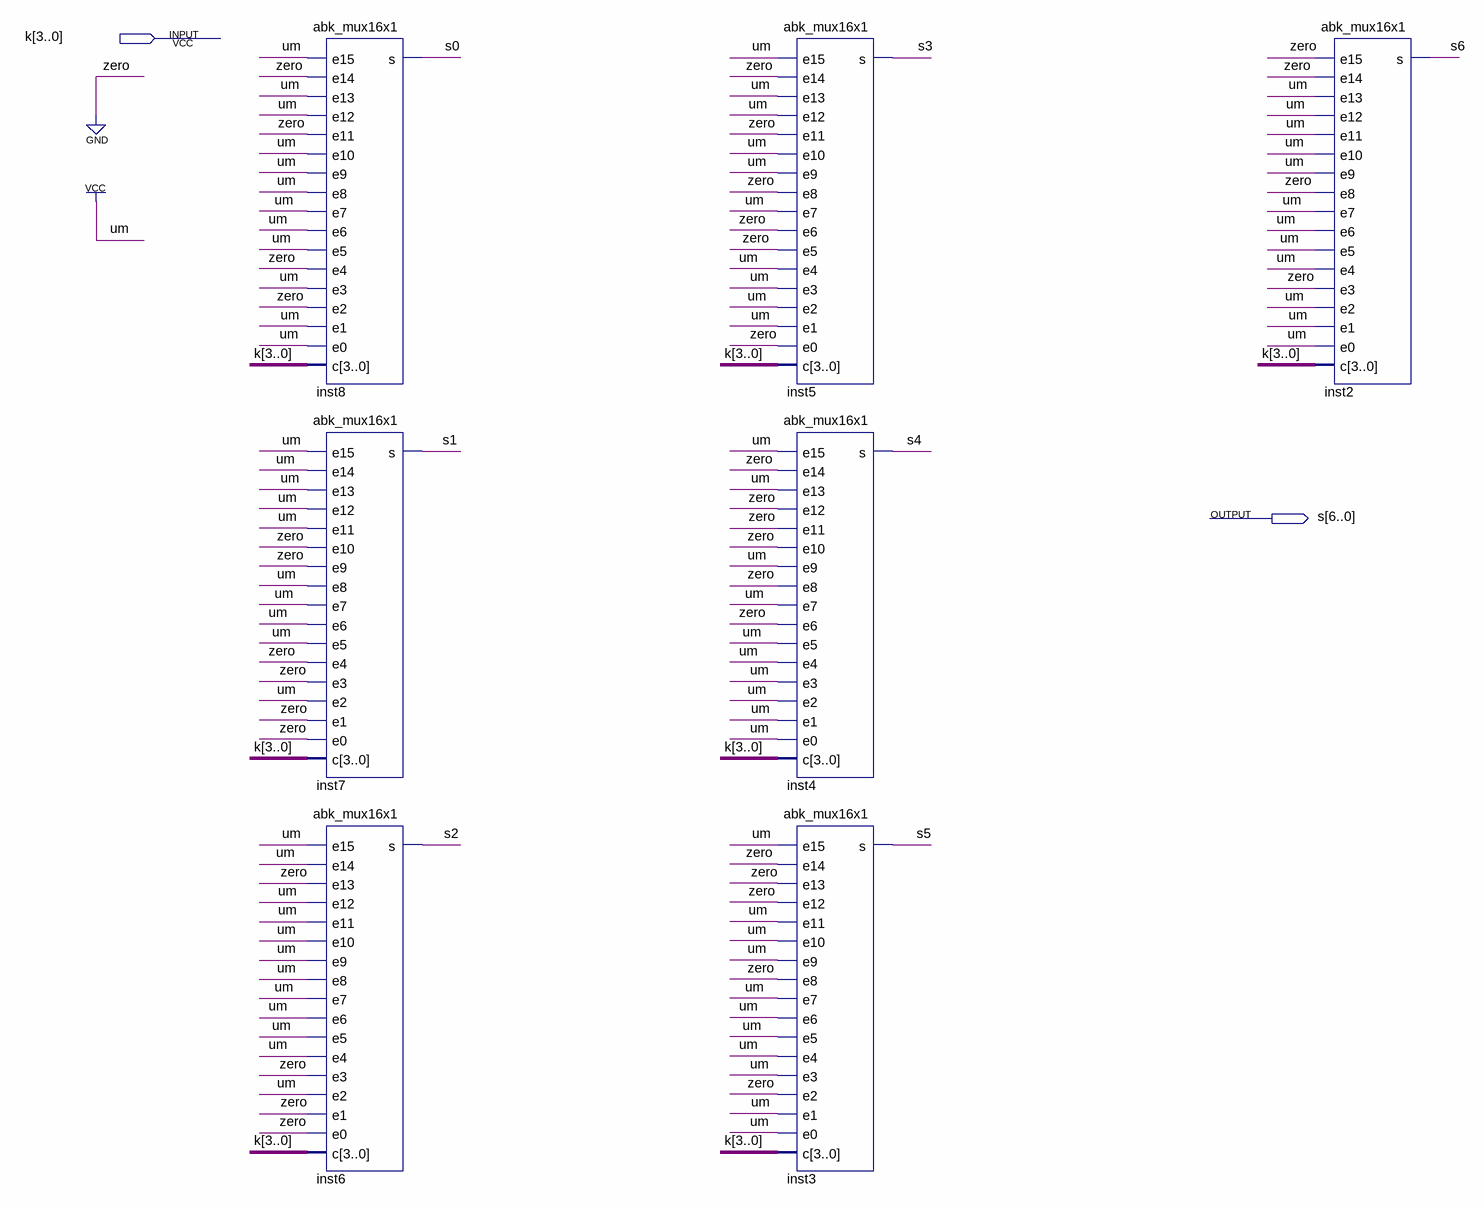
[diagram p0: schematic sheet]
// Quartus schematic abk_display_7.bdf as structural Verilog: 7 symbols, 2 pins
module abk_display_7 (
  input  [3:0] k,
  output [6:0] s
);

  abk_mux16x1 inst8 (
    .e15(1'b1), .e14(1'b0), .e13(1'b1), .e12(1'b1), .e11(1'b0), .e10(1'b1), .e9(1'b1), .e8(1'b1), .e7(1'b1),
    .e6(1'b1), .e5(1'b1), .e4(1'b0), .e3(1'b1), .e2(1'b0), .e1(1'b1), .e0(1'b1), .c(k), .s(s[0]));
  abk_mux16x1 inst7 (
    .e15(1'b1), .e14(1'b1), .e13(1'b1), .e12(1'b1), .e11(1'b1), .e10(1'b0), .e9(1'b0), .e8(1'b1), .e7(1'b1),
    .e6(1'b1), .e5(1'b1), .e4(1'b0), .e3(1'b0), .e2(1'b1), .e1(1'b0), .e0(1'b0), .c(k), .s(s[1]));
  abk_mux16x1 inst6 (
    .e15(1'b1), .e14(1'b1), .e13(1'b0), .e12(1'b1), .e11(1'b1), .e10(1'b1), .e9(1'b1), .e8(1'b1), .e7(1'b1),
    .e6(1'b1), .e5(1'b1), .e4(1'b1), .e3(1'b0), .e2(1'b1), .e1(1'b0), .e0(1'b0), .c(k), .s(s[2]));
  abk_mux16x1 inst5 (
    .e15(1'b1), .e14(1'b0), .e13(1'b1), .e12(1'b1), .e11(1'b0), .e10(1'b1), .e9(1'b1), .e8(1'b0), .e7(1'b1),
    .e6(1'b0), .e5(1'b0), .e4(1'b1), .e3(1'b1), .e2(1'b1), .e1(1'b1), .e0(1'b0), .c(k), .s(s[3]));
  abk_mux16x1 inst4 (
    .e15(1'b1), .e14(1'b0), .e13(1'b1), .e12(1'b0), .e11(1'b0), .e10(1'b0), .e9(1'b1), .e8(1'b0), .e7(1'b1),
    .e6(1'b0), .e5(1'b1), .e4(1'b1), .e3(1'b1), .e2(1'b1), .e1(1'b1), .e0(1'b1), .c(k), .s(s[4]));
  abk_mux16x1 inst3 (
    .e15(1'b1), .e14(1'b0), .e13(1'b0), .e12(1'b0), .e11(1'b1), .e10(1'b1), .e9(1'b1), .e8(1'b0), .e7(1'b1),
    .e6(1'b1), .e5(1'b1), .e4(1'b1), .e3(1'b1), .e2(1'b0), .e1(1'b1), .e0(1'b1), .c(k), .s(s[5]));
  abk_mux16x1 inst2 (
    .e15(1'b0), .e14(1'b0), .e13(1'b1), .e12(1'b1), .e11(1'b1), .e10(1'b1), .e9(1'b1), .e8(1'b0), .e7(1'b1),
    .e6(1'b1), .e5(1'b1), .e4(1'b1), .e3(1'b0), .e2(1'b1), .e1(1'b1), .e0(1'b1), .c(k), .s(s[6]));
endmodule
